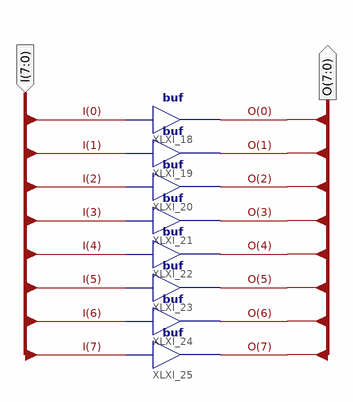
[diagram p0: schematic sheet 1]
// Xilinx ISE schematic buf8b.sch (spartan6) as structural Verilog: 8 symbols, 2 ports
module buf8b (
  input  [7:0] I,
  output [7:0] O
);

  buf XLXI_18 (O[0], I[0]);
  buf XLXI_19 (O[1], I[1]);
  buf XLXI_20 (O[2], I[2]);
  buf XLXI_21 (O[3], I[3]);
  buf XLXI_22 (O[4], I[4]);
  buf XLXI_23 (O[5], I[5]);
  buf XLXI_24 (O[6], I[6]);
  buf XLXI_25 (O[7], I[7]);
endmodule
